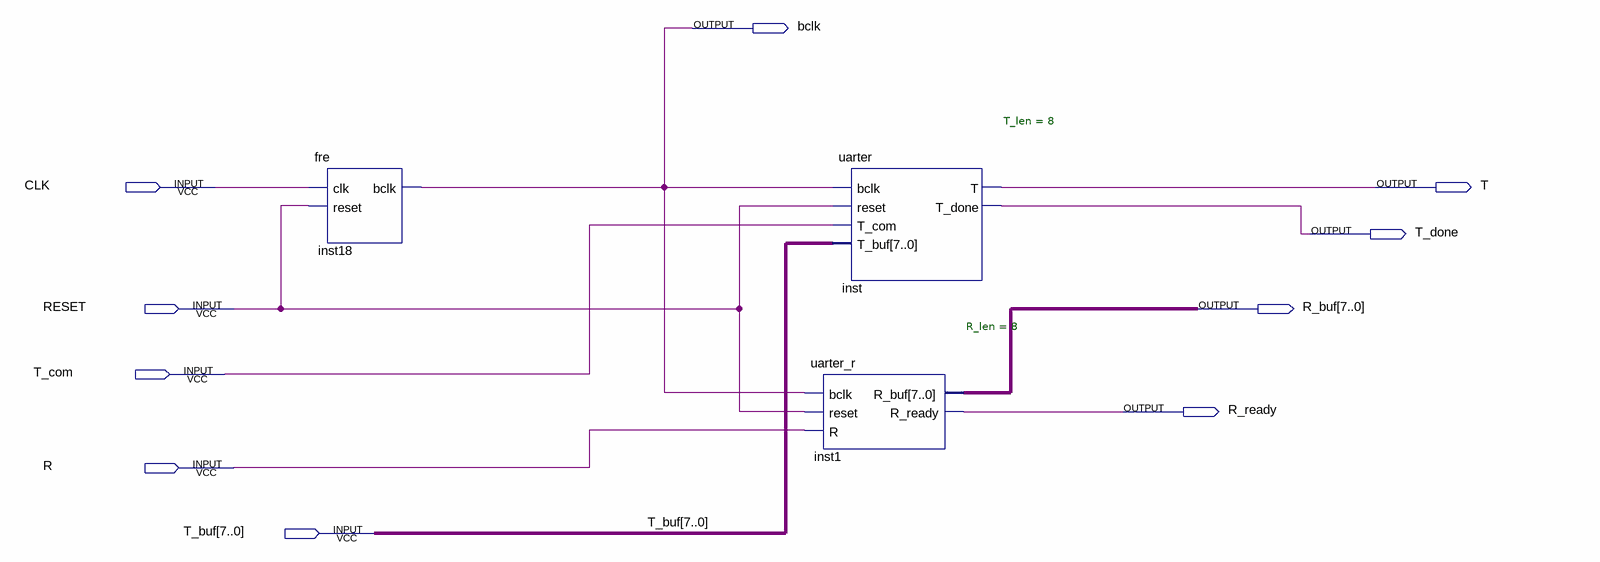
[diagram p0: schematic sheet]
// Quartus schematic all.bdf as structural Verilog: 3 symbols, 10 pins
module all (
  input  CLK,
  input  RESET,
  input  T_com,
  input  R,
  input  [7:0] T_buf,
  output bclk,
  output T,
  output T_done,
  output [7:0] R_buf,
  output R_ready
);

  fre inst18 (.clk(CLK), .reset(RESET), .bclk(bclk));
  uarter_r #(.R_len(8)) inst1 (.bclk(bclk), .reset(RESET), .R(R), .R_buf(R_buf), .R_ready(R_ready));
  uarter #(.T_len(8)) inst (.bclk(bclk), .reset(RESET), .T_com(T_com), .T_buf(T_buf), .T(T), .T_done(T_done));
endmodule
